# EasyEDA Pro project 通用采样.eprj, board NSM2015
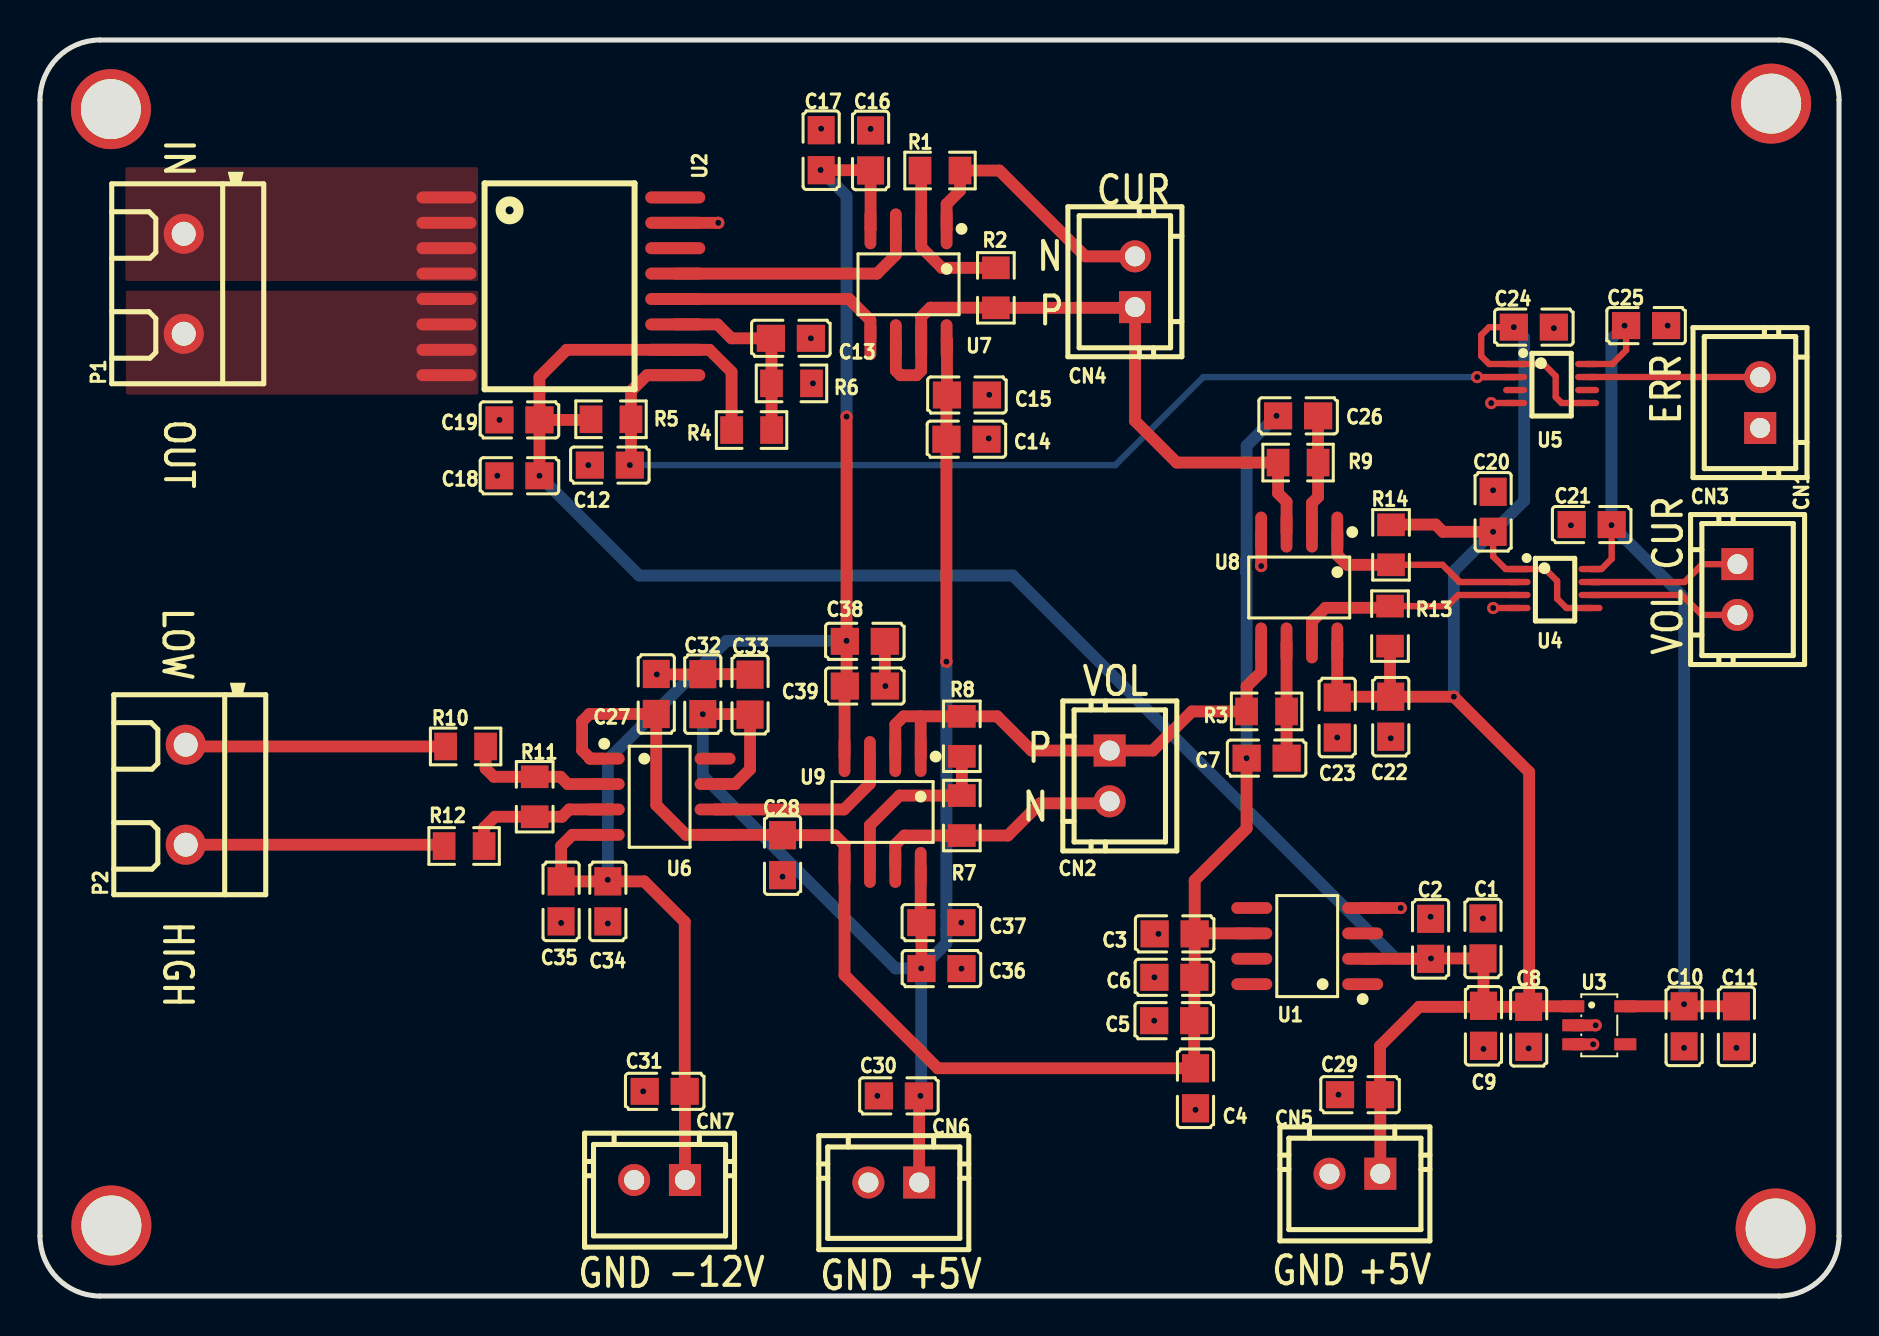
[diagram p4: board, top side]
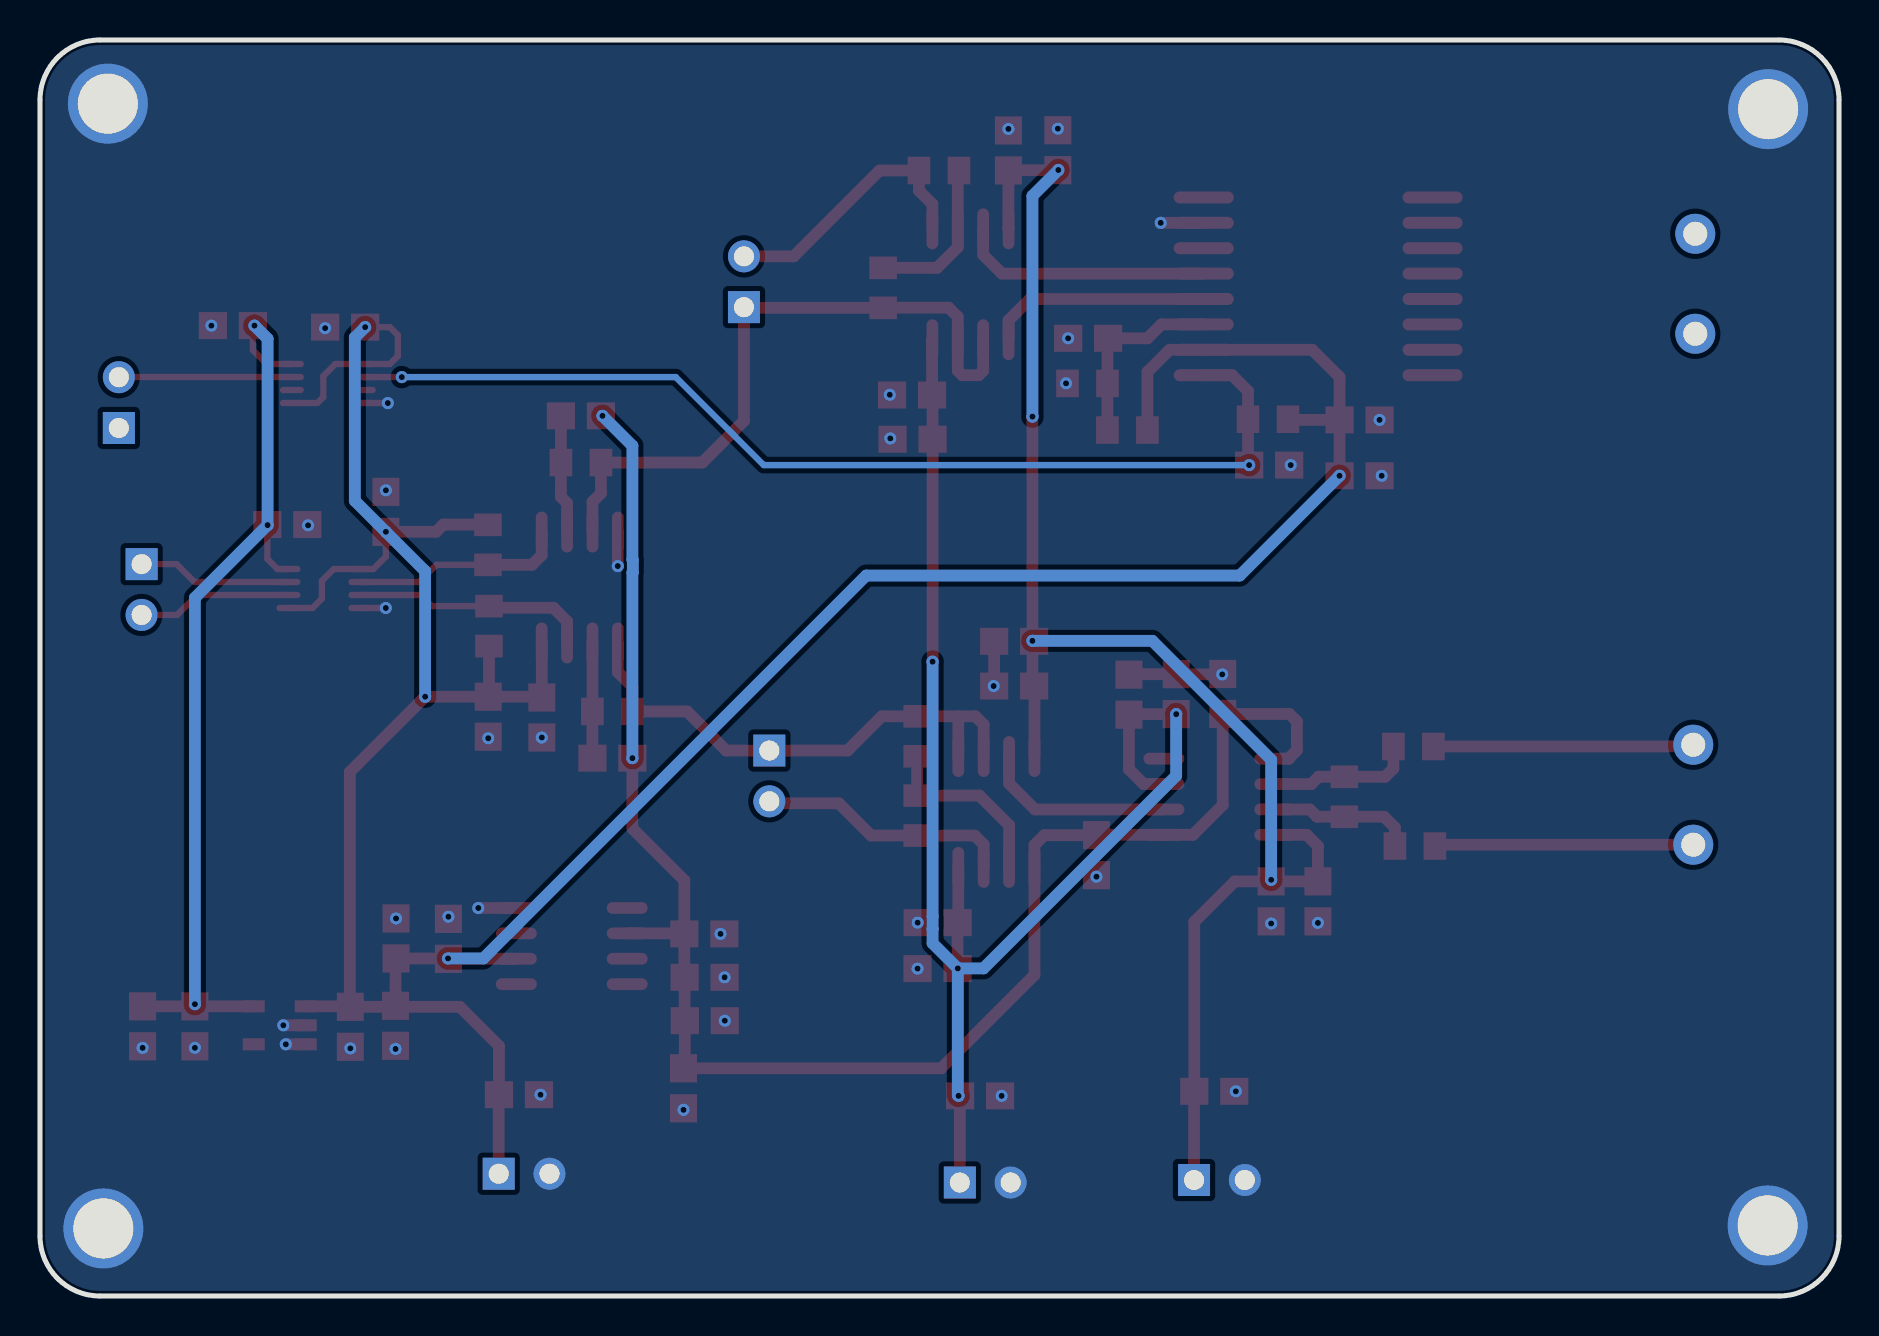
[diagram p5: board, bottom side, seen from below]

Outline 89.97 x 62.81 mm; copper layers: Top Layer, Bottom Layer. Coordinates in mm from the lower left corner of the outline.
Outline path: 0,59.81 0,3 arc(0.88,0.88) 3,0 86.97,0 arc(89.09,0.88) 89.97,3 89.97,59.81 arc(89.09,61.94) 86.97,62.81 3,62.81 arc(0.88,61.94) 0,59.81
Stack: Top Layer 0.035mm / Dielectric1 1.51mm FR4 er 4.5 / Bottom Layer 0.035mm

## Design rules (mm)
template: 自定义配置
spacing copperThickness1oz (default): track to track 0.102, other pairs 0.152 to 0.3
spacing copperThickness2oz: track to track 0.203, other pairs 0.152 to 0.3
track width copperThickness1oz (default): min 0.127, default 0.254, max 2.54
track width copperThickness2oz: min 0.203, default 0.254, max 2.54
differential pair differentialPair (default): width min 0.127, default 0.254, max 2.54; gap min 0.152, default 0.152
via viaSize (default): diameter min 0.5, default 0.61, max 10; hole min 0.3, default 0.305, max 6.3

## Placement (name value [footprint] x y rotation side)
C1  4.7uF  [C0805]  72.16 17.88 270 top
C2  100nF  [C0805]  69.54 17.86 270 top
C3  100nF  [C0805]  56.74 18.11 0 top
C4  4.7uF  [C0805]  57.78 10.39 90 top
C5  4.7uF  [C0805]  56.72 13.77 0 top
C6  4.7uF  [C0805]  56.73 15.94 0 top
C7  100nF  [C0805]  61.34 26.9 0 top
C8  1uF  [C0805]  74.45 13.46 270 top
C9  100nF  [C0805]  72.19 13.51 270 top
C10  1uF  [C0805]  82.22 13.49 270 top
C11  100nF  [C0805]  84.84 13.49 270 top
C12  100nF  [C0805]  28.5 41.55 0 top
C13  100nF  [C0805]  37.55 47.89 0 top
C14  100nF  [C0805]  46.33 42.85 180 top
C15  1uF  [C0805]  46.35 45.06 180 top
C16  100nF  [C0805]  41.54 57.29 270 top
C17  1uF  [C0805]  39.06 57.3 270 top
C18  100nF  [C0805]  23.98 41.02 0 top
C19  1uF  [C0805]  23.98 43.81 0 top
C20  100nF  [C0805]  72.67 39.22 90 top
C21  100nF  [C0805]  77.6 38.58 180 top
C22  1uF  [C0805]  67.55 28.97 90 top
C23  100nF  [C0805]  64.87 28.93 90 top
C24  100nF  [C0805]  74.71 48.45 0 top
C25  100nF  [C0805]  80.32 48.53 0 top
C26  100nF  [C0805]  62.92 44.02 0 top
C27  1uF  [C0805]  30.82 30.11 90 top
C28  1uF  [C0805]  37.13 22.05 270 top
C29  10uF  [C0805]  66.01 10.07 0 top
C30  10uF  [C0805]  42.95 10.01 0 top
C31  10uF  [C0805]  31.24 10.24 0 top
C32  100nF  [C0805]  33.15 30.1 270 top
C33  1uF  [C0805]  35.51 30.07 270 top
C34  100nF  [C0805]  28.4 19.74 90 top
C35  1uF  [C0805]  26.06 19.74 90 top
C36  100nF  [C0805]  45.08 16.37 180 top
C37  1uF  [C0805]  45.08 18.67 180 top
C38  100nF  [C0805]  41.25 32.74 180 top
C39  1uF  [C0805]  41.25 30.5 180 top
CN1  CON2-2.54*2P  [CONN-TH_2P-P2.54-V]  84.89 35.33 270 top
CN2  CON2-2.54*2P  [CONN-TH_2P-P2.54-V]  53.49 26.01 270 top
CN3  CON2-2.54*2P  [CONN-TH_2P-P2.54-V]  86.02 44.68 90 top
CN4  CON2-2.54*2P  [CONN-TH_2P-P2.54-V]  54.76 50.72 90 top
CN5  CON2-2.54*2P  [CONN-TH_2P-P2.54-V]  65.76 6.11 180 top
CN6  CON2-2.54*2P  [CONN-TH_2P-P2.54-V]  42.7 5.68 180 top
CN7  CON2-2.54*2P  [CONN-TH_2P-P2.54-V]  30.98 5.8 180 top
NOREF  -  [Pad_e1320]  86.8 3.38 0 top
NOREF#2  -  [Pad_e1319]  3.57 3.53 0 top
NOREF#3  -  [Pad_e1321]  86.57 59.63 0 top
NOREF#4  -  [Pad_e1317]  3.54 59.36 0 top
P1  KF301-2P接线端子  [CONN-TH_XY301V-A-5.0-2P]  7.19 50.62 90 top
P2  KF301-2P接线端子  [CONN-TH_XY301V-A-5.0-2P]  7.29 25.07 90 top
R1  10K  [R0805]  45.01 56.29 180 top
R2  10K  [R0805]  47.8 50.42 90 top
R3  10K  [R0805]  61.34 29.23 0 top
R4  10K  [R0805]  35.59 43.31 180 top
R5  10K  [R0805]  28.56 43.85 0 top
R6  10K  [R0805]  37.58 45.64 180 top
R7  10K  [R0805]  46.1 24.03 90 top
R8  10K  [R0805]  46.1 27.99 270 top
R9  10K  [R0805]  62.92 41.68 0 top
R10  10K  [R0805]  21.28 27.48 180 top
R11  10K  [R0805]  24.74 24.97 90 top
R12  10K  [R0805]  21.21 22.5 0 top
R13  10K  [R0805]  67.51 33.5 270 top
R14  10K  [R0805]  67.56 37.57 90 top
U1  REF5025AIDR  [SOIC-8_L4.9-W3.9-P1.27-LS6.0-BL]  63.37 17.5 90 top
U2  SOW16  [NSM2015]  25.98 50.49 270 top
U3  TLV75533PDBVR  [SOT-23-5_L3.0-W1.7-P0.95-LS2.8-BR]  77.98 13.54 180 top
U4  SN74LVC2T45DCTR  [SM8_L3.2-W2.9-P0.65-LS4.3-BR]  75.74 35.38 180 top
U5  SN74LVC2T45DCTR  [SM8_L3.2-W2.9-P0.65-LS4.3-BR]  75.57 45.63 180 top
U6  INA149AID  [SOIC-8_L4.9-W3.9-P1.27-LS6.0-BL]  30.99 24.97 270 top
U7  OPA2192IDR  [SOIC-8_L4.9-W3.9-P1.27-LS6.0-BL]  43.43 50.6 180 top
U8  TLV3202AIDR  [SOIC-8_L4.9-W3.9-P1.27-LS6.0-BL]  62.97 35.43 180 top
U9  OPA2192IDR  [SOIC-8_L4.9-W3.9-P1.27-LS6.0-BL]  42.14 24.21 180 top

## Footprints (pads in the part's own frame, mm; a bottom-side part is the same pattern mirrored in y, then rotated)
C0805
  rect 1.41x1.35 smd: 1(-1,0) 2(1,0)
CONN-TH_2P-P2.54-V
  rect 1.6x1.6 hole 1: 1(-1.27,0)
  round 1.6 hole 1: 2(1.27,0)
CONN-TH_XY301V-A-5.0-2P
  round 2 hole 1.2: 1(-2.5,0) 2(2.5,0)
NSM2015
  oval 0.6x3 smd: 1(-4.445,-5.658) 2(-3.175,-5.658) 3(-1.905,-5.658) 4(-0.635,-5.658) 5(0.635,-5.658) 6(1.905,-5.658) 7(3.175,-5.658) 8(4.445,-5.658) 9(4.445,5.785) 10(3.175,5.785) 11(1.905,5.785) 12(0.635,5.785) 13(-0.635,5.785) 14(-1.905,5.785) 15(-3.175,5.785) 16(-4.445,5.785)
Pad_e1317
  round 4 hole 3: 1(0,0)
Pad_e1319
  round 4 hole 3: 1(0,0)
Pad_e1320
  round 4 hole 3: 1(0,0)
Pad_e1321
  round 4 hole 3: 1(0,0)
R0805
  rect 1.133x1.377 smd: 1(-1,0) 2(1,0)
SM8_L3.2-W2.9-P0.65-LS4.3-BR
  oval 1.198x0.315 smd: 1(1.799,-0.975) 2(1.799,-0.325) 3(1.799,0.325) 4(1.799,0.975) 5(-1.799,0.975) 6(-1.799,0.325) 7(-1.799,-0.325) 8(-1.799,-0.975)
SOIC-8_L4.9-W3.9-P1.27-LS6.0-BL
  oval 0.588x2.045 smd: 1(-1.905,-2.772) 2(-0.635,-2.772) 3(0.635,-2.772) 4(1.905,-2.772) 5(1.905,2.772) 6(0.635,2.772) 7(-0.635,2.772) 8(-1.905,2.772)
SOT-23-5_L3.0-W1.7-P0.95-LS2.8-BR
  rect 1.1x0.6 smd: 1(1.3,-0.95) 2(1.3,0) 3(1.3,0.95) 4(-1.3,0.95) 5(-1.3,-0.95)

## Nets
As in the schematic, except:
GND: C1.1 C2.1 C3.1 C4.1 C5.1 C6.1 C8.2 C9.2 C10.2 C11.2 C12.1 C13.2 C14.1 C15.1 C16.1 C17.1 C18.1 C19.1 C20.2 C21.2 C22.1 C23.1 C24.2 C25.2 C27.2 C28.2 C29.1 C30.1 C31.1 C32.1 C33.1 C34.1 C35.1 C36.1 C37.1 C38.1 C39.1 CN5.2 CN6.2 CN7.2 NOREF.1 NOREF#2.1 NOREF#3.1 NOREF#4.1 R6.1 U1.4 U2.15 U3.2 U3.3 U4.4 U5.4 U8.4

Pads without a net: CN3 1; U1 1 3 5 7 8; U2 14 16; U3 4; U5 3 6; U6 8

## Via types
v1: diameter 0.61, hole 0.305, Top Layer to Bottom Layer, 62 vias

## Routing (per net, layer and track width the routed paths; a pad name or vN(x,y) marks a point on that pad's centre or on a via; arc(x,y) is an arc through that point)
3.3V: length 47.7
  Top Layer w0.315: C21.1 78.6,36.87 78.09,36.36 U4.8 ; C25.1 79.32,47.3 78.63,46.61 77.37,46.61
  Top Layer w0.588: C11.1 C10.1 79.28,14.49
  Bottom Layer w0.588: v1(82.22,14.59) 82.22,34.92 v1(78.59,38.55) 78.59,47.87 v1(79.24,48.53)
+2.5V: length 84.6
  Top Layer w0.588: U1.6 57.77,18.14 C3.2 ; C3.2 57.74,15.95 C6.2 57.73,13.78 C5.2 57.72,11.45 C4.2 44.9,11.39 40.23,16.05 U9.5 40.23,22.55 39.74,23.05 C28.1 37.12,23.06 U6.5 32.31,23.06 30.82,24.55 C27.1 27.48,29.11 27.11,28.74 27.11,27.29 27.53,26.87 U6.1 ; C3.2 57.74,20.79 60.34,23.38 v1(60.34,26.9)
  Bottom Layer w0.588: v1(60.34,26.9) 60.34,36.17 60.32,36.19 60.32,36.82 60.34,36.84 60.34,42.52 v1(61.84,44.02)
+5V: length 171.9
  Top Layer w0.315: v1(73.71,48.45) 72.47,48.45 72.07,48.06 72.07,47.01 72.47,46.61 75.19,46.61 75.8,46.01 75.8,44.96 76.09,44.66 U5.5 ; U4.5 76.34,34.41 75.87,34.87 75.87,35.76 75.28,36.36 73.29,36.36 72.67,36.98 v1(72.67,38.22)
  Top Layer w0.588: 74.47,14.49 74.47,26.2 v1(70.71,29.97) C22.2 ; 74.47,14.49 C8.1 72.24,14.46 ; 74.47,14.49 U3.1 ; v1(24.98,41.02) C19.2 24.98,45.96 26.34,47.32 U2.10 33.48,47.32 34.59,46.21 R4.2 ; 72.24,14.46 68.97,14.46 67.01,12.5 C29.2 67.03,10.05 CN5.1 ; 72.24,14.46 C9.1 72.19,16.86 C1.2 v1(69.56,16.88) C2.2 69.54,16.87 U1.2 ; R14.2 67.58,38.58 69.8,38.58 70.16,38.22 v1(72.67,38.22) ; U8.8 64.87,32.65 C23.2 64.91,29.97 C22.2 ; 25.06,43.81 27.52,43.81 R5.1 ; R13.2 67.51,30.01 C22.2
  Bottom Layer w0.588: v1(73.71,48.45) 74.22,47.94 74.22,39.77 v1(72.67,38.22) 70.71,36.25 v1(70.71,29.97) ; v1(24.98,41.02) 29.97,36.03 48.65,36.03 67.79,16.88 v1(69.56,16.88)
+12V: length 72.9
  Top Layer w0.588: C30.2 43.97,10 CN6.1 ; v1(33.15,29.1) 35.21,29.1 35.43,28.88 ; U7.8 45.35,47.81 C15.2 45.33,45.03 C14.2 v1(45.33,31.72) ; C36.2 44.08,18.67 C37.2 44.04,18.7 U9.8 ; U6.7 34.77,25.6 35.51,26.34 C33.2
  Bottom Layer w0.588: v1(44.07,16.38) 45.33,17.64 45.33,18.36 45.33,18.36 45.33,18.98 45.33,18.99 v1(45.33,31.72) ; v1(44.07,16.38) 44.07,10.05 v1(44.03,10.01) ; v1(44.07,16.38) 42.78,16.38 33.15,26.02 v1(33.15,29.1)
-12V: length 79.8
  Top Layer w0.588: U7.4 41.54,53.38 C16.2 41.52,56.3 C17.2 ; U6.4 26.62,23.06 26.06,22.5 C35.2 C34.2 30.22,20.74 32.24,18.71 C31.2 32.25,10.22 CN7.1 ; U9.4 40.23,30.49 C39.2 40.34,30.59 v1(40.34,32.77) v1(40.34,43.98)
  Bottom Layer w0.588: v1(40.34,43.98) 40.34,55.02 v1(39.04,56.31) ; v1(40.34,32.77) 34.34,32.77 28.4,26.82 v1(28.4,20.81)
GND: length 17.3
  Top Layer w0.315: U5.4 72.58,44.66 v1(72.57,44.66) ; 73.94,34.41 v1(72.67,34.41)
  Top Layer w0.588: U3.3 v1(77.67,12.59) ; U2.15 v1(33.92,53.67) ; C33.1 35.48,31.1 C32.1 33.14,31.09 v1(30.84,31.09) ; 61.07,38.2 61.07,36.51 v1(61.07,36.5) ; 66.15,19.4 v1(68.05,19.4) ; U3.2 v1(77.8,13.54) ; v1(42.28,30.5) 42.25,30.53 C38.1
  vias: v1(22.87,41.02) v1(22.98,43.81) v1(26.06,18.66) v1(27.42,41.55) v1(28.4,18.63) v1(30.16,10.24) v1(37.13,20.97) v1(38.55,47.89) v1(38.66,45.64) v1(39.06,58.38) v1(41.54,58.37) v1(41.88,10.01) v1(46.08,18.67) v1(46.08,16.37) v1(47.47,45.07) v1(47.44,42.89) v1(55.73,15.94) v1(55.72,13.77) v1(55.94,18.11) v1(57.78,9.31) v1(64.87,27.93) v1(64.94,10.07) v1(67.55,27.89) v1(69.54,18.97) v1(72.16,18.88) v1(72.19,12.36) v1(72.67,40.29) v1(74.45,12.38) v1(75.71,48.4) v1(76.56,38.54) v1(81.4,48.53) v1(82.22,12.41) v1(84.84,12.41)
CUR_3V: length 7.7
  Top Layer w0.315: U4.7 82.24,35.71 83.13,36.6 CN1.1
CUR_5V: length 10.8
  Top Layer w0.315: R14.1 70.14,36.57 71,35.71 73.94,35.71
  Top Layer w0.588: R14.1 65.36,36.57 64.88,37.05 64.88,38.2
CUR_N: length 13.7
  Top Layer w0.588: U7.1 45.34,54.61 46.01,55.28 R1.1 47.98,56.29 52.27,51.99 CN4.2
CUR_P: length 34
  Top Layer w0.588: U7.6 42.8,46.28 43.03,46.05 43.84,46.05 44.07,46.28 U7.7 44.07,48.97 44.53,49.43 47.79,49.43 R2.1 54.73,49.42 CN4.1 54.76,43.76 56.84,41.68 R9.1 61.92,40.14 62.34,39.72 62.34,38.2
ERR_3V: length 8.7
  Top Layer w0.315: CN3.2 86.01,45.96 U5.7
ERR_5V: length 52.4
  Top Layer w0.315: v1(71.87,45.96) 73.77,45.96 U5.2
  Top Layer w0.588: U2.9 30.35,46.05 29.56,45.25 R5.2 29.56,41.61 v1(29.5,41.55)
  Bottom Layer w0.315: v1(29.5,41.55) 53.77,41.55 58.17,45.96 v1(71.87,45.96)
VOL_3V: length 7.8
  Top Layer w0.315: CN1.2 83.11,34.06 82.11,35.06 U4.6
VOL_5V: length 12
  Top Layer w0.315: R13.1 70.37,34.5 70.92,35.06 73.94,35.06
  Top Layer w0.588: R13.1 67.43,34.42 64.29,34.42 63.61,33.74 U8.7
VOL_H: length 12.9
  Top Layer w0.588: P2.1 20.14,22.57 R12.1
VOL_L: length 13
  Top Layer w0.588: P2.2 7.38,27.48 R10.2
VOL_N: length 12.8
  Top Layer w0.588: CN2.2 53.39,24.64 50.01,24.64 48.4,23.03 R7.1 43.22,23.03 42.77,22.58 U9.7
VOL_P: length 26.6
  Top Layer w0.588: U9.2 42.77,28.57 43.19,28.99 44.04,28.99 ; 44.04,28.99 R8.1 47.87,28.99 49.58,27.28 CN2.1 55.65,27.28 57.61,29.23 R3.1 60.34,30.47 61.07,31.2 U8.5 ; 44.04,28.99 U9.1
$1N2376: length 7.4
  Top Layer w0.588: U6.2 26.39,25.6 26.03,25.97 R11.2 22.7,25.97 22.28,26.38 R10.1
$1N2394: length 7.3
  Top Layer w0.588: R12.2 22.21,23.43 22.75,23.97 R11.1 26.1,23.97 26.47,24.33 U6.3
$1N2836: length 9.6
  Top Layer w0.588: U6.6 40.21,24.33 41.5,25.63 U9.3
$1N2969: length 9.3
  Top Layer w0.588: U9.6 41.5,23.55 42.99,25.03 R7.2 R8.2
$1N3236: length 11.2
  Top Layer w0.588: U7.5 41.53,48.79 40.46,49.86 U2.12
$1N3246: length 8
  Top Layer w0.588: R2.2 45.1,51.42 44.07,52.45 U7.2 44.07,56.23 R1.2
$1N3251: length 12.7
  Top Layer w0.588: U7.3 42.8,52.07 41.86,51.13 U2.13
$1N4341: length 5.8
  Top Layer w0.588: 62.34,32.66 62.34,29.24 R3.2 C7.2
$1N4495: length 5.9
  Top Layer w0.588: 63.61,38.2 63.61,39.66 63.92,39.96 R9.2 C26.2
$1N6348: length 9.7
  Top Layer w0.588: R4.1 36.59,45.64 R6.2 36.58,47.86 C13.1 34.58,47.89 33.88,48.59 U2.11

## Copper pours and planes (outline as drawn; the poured copper is in the pictures)
GND on Bottom Layer: -0.56,63.45 90.47,63.45 90.47,-0.33 -0.56,-0.33
CUR_IN on Top Layer: 4.27,56.46 21.91,56.46 21.91,50.76 4.27,50.76
CUR_OUT on Top Layer: 4.29,50.28 21.92,50.28 21.92,45.08 4.29,45.08

## Text on the board
Top Silkscreen Layer: GND | -12V | +5V | N | P | VOL | CUR | ERR | LOW | HIGH | IN | OUT
